# Altium schematic sheet SER.SchDoc
size A4
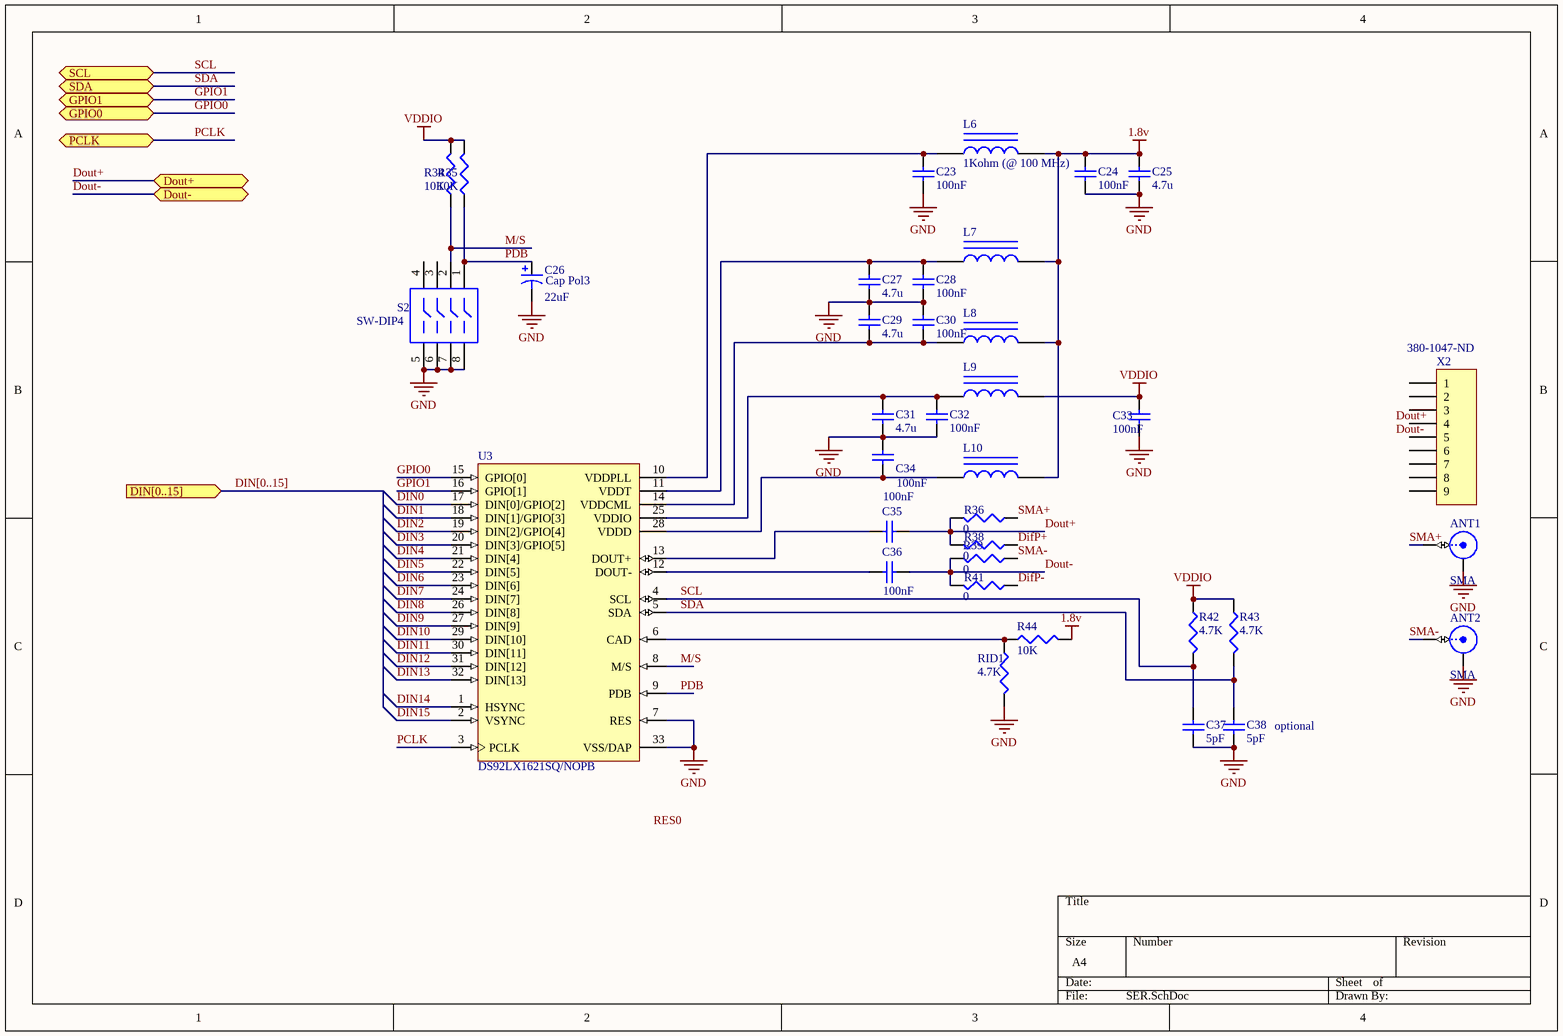
[diagram p0: SER.SchDoc]

## Parts
ANT1  SMA  [SMB_V-RJ45]
ANT2  SMA  [SMB_V-RJ45]
C23  value 100nF  [1608[0603]]  (hidden comment: Cap Semi)
C24  value 100nF  [1608[0603]]  (hidden comment: Cap Semi)
C25  value 4.7u  [1608[0603]]  (hidden comment: Cap Semi)
C26  Cap Pol3  value 22uF  [C0805]
C27  value 4.7u  [1608[0603]]  (hidden comment: Cap Semi)
C28  value 100nF  [1608[0603]]  (hidden comment: Cap Semi)
C29  value 4.7u  [1608[0603]]  (hidden comment: Cap Semi)
C30  value 100nF  [1608[0603]]  (hidden comment: Cap Semi)
C31  value 4.7u  [1608[0603]]  (hidden comment: Cap Semi)
C32  value 100nF  [1608[0603]]  (hidden comment: Cap Semi)
C33  value 100nF  [1608[0603]]  (hidden comment: Cap Semi)
C34  value 100nF  [1608[0603]]  (hidden comment: Cap Semi)
C35  value 100nF  [1608[0603]]  (hidden comment: Cap Semi)
C36  value 100nF  [1608[0603]]  (hidden comment: Cap Semi)
C37  value 5pF  [1608[0603]]  (hidden comment: Cap Semi)
C38  value 5pF  [1608[0603]]  (hidden comment: Cap Semi)
L6  1Kohm (@ 100 MHz)  [0805]
L7  (no value)  [0805]
L8  (no value)  [0805]
L9  (no value)  [0805]
L10  (no value)  [0805]
R34  value 10K  [12Z-2010]  (hidden comment: Res3)
R35  value 10K  [12Z-2010]  (hidden comment: Res3)
R36  value 0  [12Z-2010]  (hidden comment: Res3)
R38  value 0  [12Z-2010]  (hidden comment: Res3)
R39  value 0  [12Z-2010]  (hidden comment: Res3)
R41  value 0  [12Z-2010]  (hidden comment: Res3)
R42  value 4.7K  [12Z-2010]  (hidden comment: Res3)
R43  value 4.7K  [12Z-2010]  (hidden comment: Res3)
R44  value 10K  [12Z-2010]  (hidden comment: Res3)
RID1  value 4.7K  [12Z-2010]  (hidden comment: Res3)
S2  SW-DIP4  [DIP-8]
U3  DS92LX1621SQ/NOPB  [SQA32A]
X2  Supplier Part Number 1: 380-1047-ND  [rj-45]  (hidden comment: SS-7188S-A-NF)

## Ports
DIN[0..15] (in), Dout+, Dout-, GPIO0, GPIO1, PCLK, SCL, SDA

## Nets
1.8v: C24.2 C25.2 L6.2 L7.2 L8.2 L10.2 R44.2
GND: ANT1.2(Y) ANT2.2(Y) C23.1 C24.1 C25.1 C26.2 C27.1 C28.1 C29.2 C30.2 C31.1 C32.1 C33.1 C34.2 C37.1 C38.1 RID1.2 S2.5 S2.6 S2.7 S2.8 U3.7(RES) U3.33(VSS/DAP)
VDDIO: C33.2 L9.2 R34.1 R35.1 R42.1 R43.1
DifP+: R38.1
DifP-: R41.1
DIN0: U3.17(DIN[0]/GPIO[2])
DIN1: U3.18(DIN[1]/GPIO[3])
DIN2: U3.19(DIN[2]/GPIO[4])
DIN3: U3.20(DIN[3]/GPIO[5])
DIN4: U3.21(DIN[4])
DIN5: U3.22(DIN[5])
DIN6: U3.23(DIN[6])
DIN7: U3.24(DIN[7])
DIN8: U3.26(DIN[8])
DIN9: U3.27(DIN[9])
DIN10: U3.29(DIN[10])
DIN11: U3.30(DIN[11])
DIN12: U3.31(DIN[12])
DIN13: U3.32(DIN[13])
DIN14: U3.1(HSYNC)
DIN15: U3.2(VSYNC)
Dout+: C35.2 R36.2 R38.2 ; port Dout+
Dout-: C36.2 R39.2 R41.2 ; port Dout-
GPIO0: U3.15(GPIO[0]) ; port GPIO0
GPIO1: U3.16(GPIO[1]) ; port GPIO1
M/S: R34.2 S2.2 U3.8(M/S)
PCLK: U3.3(PCLK) ; port PCLK
PDB: C26.1 R35.2 S2.1 U3.9(PDB)
SCL: C37.2 R42.2 U3.4(SCL) ; port SCL
SDA: C38.2 R43.2 U3.5(SDA) ; port SDA
SMA+: ANT1.1(IO) R36.1
SMA-: ANT2.1(IO) R39.1
NetC23_2: C23.2 L6.1 U3.10(VDDPLL)
NetC27_2: C27.2 C28.2 L7.1 U3.11(VDDT)
NetC29_1: C29.1 C30.1 L8.1 U3.14(VDDCML)
NetC31_2: C31.2 C32.2 L9.1 U3.25(VDDIO)
NetC34_1: C34.1 L10.1 U3.28(VDDD)
NetC35_1: C35.1 U3.13(DOUT+)
NetC36_1: C36.1 U3.12(DOUT-)
NetR44_1: R44.1 RID1.1 U3.6(CAD)

Not connected (* = marked no-connect by the designer): S2 3 4; X2 1 2 3 4 5 6 7 8 9

## Buses and harness runs
bus DIN[0..15] = port DIN[0..15]

## Notes on the sheet
- (near C38) optional
- Labels drawn without touching a wire or pin: Dout+, Dout-, RES0

## Library data of the parts
ANT1 ANT2 = SMA-J-P-H-ST-EM1: SMA 50 Ohm Edge Mount; Lager: No; PN RS: *
C23-C25 C27-C34 C37 C38 = Cap Semi: Capacitor (Semiconductor SIM Model); Published: 8-Jun-2000; LatestRevisionDate: 29-May-2009; LatestRevisionNote: IPC-7351 Footprint Added.; PackageReference: C1206; Publisher: Altium Limited; PackageDescription: Chip Capacitor
C26 = Cap Pol3: Polarized Capacitor (Surface Mount); Published: 8-Jun-2000; LatestRevisionDate: 29-May-2009; LatestRevisionNote: IPC-7351 Footprint Added.; PackageReference: C0805; Publisher: Altium Limited; PackageDescription: Chip Capacitor
C35 C36 = Cap Semi: CAP CER 0.1UF 50V X7R 0603; Published: 8-Jun-2000; LatestRevisionDate: 29-May-2009; LatestRevisionNote: IPC-7351 Footprint Added.; PackageReference: C1206; Publisher: Altium Limited; PackageDescription: Chip Capacitor
L6 = Inductor Iron: Impedance = 1Kohm (@ 100 MHz)  low DC resistance (<1ohm); Published: 24-Mar-1999; LatestRevisionDate: 17-Jul-2002; LatestRevisionNote: Re-released for DXP Platform.; PackageReference: AXIAL-0.9; Publisher: Altium Limited; PackageDescription: Axial Device, Thru-Hole; 2 Leads; 0.9 in Pin Spacing
L7-L10 = Inductor Iron: Impedance = 1 kohm (@ 100 MHz)  low DC resistance (<1ohm); Published: 24-Mar-1999; LatestRevisionDate: 17-Jul-2002; LatestRevisionNote: Re-released for DXP Platform.; PackageReference: AXIAL-0.9; Publisher: Altium Limited; PackageDescription: Axial Device, Thru-Hole; 2 Leads; 0.9 in Pin Spacing
R34-R36 R38 R39 R41-R44 RID1 = Res3: Resistor; Published: 8-Jun-2000; LatestRevisionDate: 29-May-2009; LatestRevisionNote: IPC-7351 Footprint Added.; PackageReference: J1-0603; Publisher: Altium Limited; PackageDescription: Chip Resistor
S2 = SW-DIP4: DIP Switch; Published: 24-Mar-1999; LatestRevisionDate: 17-Jul-2002; LatestRevisionNote: Re-released for DXP Platform.; PackageReference: DIP-8; Publisher: Altium Limited
U3 = DS92LX1621SQ/NOPB: 10 - 50 MHz DC-Balanced Channel Link III Bi-Directional Control Serializer, 32 pin LLP; Manufacturer: National Semiconductor; PackageTopMarking: NS*UZXYTT*LX1621; PowerWise: N; CompType: Interface IC; Published: 16-Nov-2010; DatasheetVersion: Sep-2010; PackageVersion: revB, Oct-2009; PackageReference: SQA32A; Publisher: Altium Limited; PackageDescription: LLP, Quad, 5 x 5 x 0.8mm, 32 Lead, 0.5mm Pitch, No Pullback 3.1 x 3.1 Exposed Pad; PartNumber: DS92LX1621SQ/NOPB; RoHS: Y; PinCount: 32; ComponentLink1Description: DS92LX1621 Datasheet; ComponentLink1URL: http://www.national.com/ds/DS/DS92LX1621.pdf; ComponentLink2Description: DS92LX1621 Web Page; ComponentLink2URL: http://www.national.com/pf/DS/DS92LX1621.html; ComponentLink3Description: SQA32A Package Page; ComponentLink3URL: http://www.national.com/packaging/folders/sqa32a.html
X2 = Header 9: CONN MOD JACK 8P8C R/A SHIELDED; Manufacturer: Stewart Connector; Number of Positions/Contacts: 8p8c (RJ45, Ethernet); Number of Ports: 1; Ratings: Cat5e; LED Color: Does Not Contain LED; Tab Direction: Down; LatestRevisionDate: 17-Jul-2002; LatestRevisionNote: Re-released for DXP Platform.; Publisher: Altium Limited; Supplier 1: Digi-Key; Manufacturer Part Number: SS-7188S-A-NF; RoHS: RoHS Compliant; Category: Connectors, Interconnects; Stock 1: 7949; Pricing 1: 1=1.7, 10=1.546, 25=1.4512, 50=1.3882, 100=1.3251, 250=1.19892, 500=1.10426, 1000=0.9465, 2500=0.8834 (USD); Packaging: Bulk; Part Status: Active; Connector Type: Jack; Number of Rows: 1; Mounting Type: Through Hole; Orientation: 90° Angle (Right); Termination: Solder; Shielding: Shielded; Features: Board Lock; Ingress Protection: -; Contact Material: Copper Alloy; Contact Finish: Gold; Contact Finish Thickness: 30µin (0.76µm); Housing Material: Thermoplastic; Operating Temperature: -40°C ~ 85°C; ComponentLink1URL: https://belfuse.com/resources/StewartConnector/Stewart%20Data%20Sheets/CT710001.pdf; ComponentLink1Description: https://belfuse.com/resources/StewartConnector/Stewart%20Data%20Sheets/CT710001.pdf